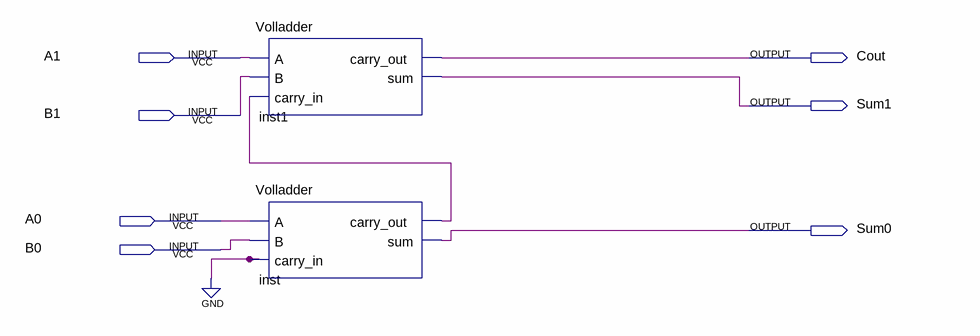
[diagram p0: schematic sheet]
// Quartus schematic carry_ripple.bdf as structural Verilog: 2 symbols, 7 pins
module carry_ripple (
  input  A1,
  input  B1,
  input  A0,
  input  B0,
  output Cout,
  output Sum1,
  output Sum0
);

  wire inst_carry_out;

  Volladder inst1 (.A(A1), .B(B1), .carry_in(inst_carry_out), .carry_out(Cout), .sum(Sum1));
  Volladder inst (.A(A0), .B(B0), .carry_in(1'b0), .carry_out(inst_carry_out), .sum(Sum0));
endmodule
